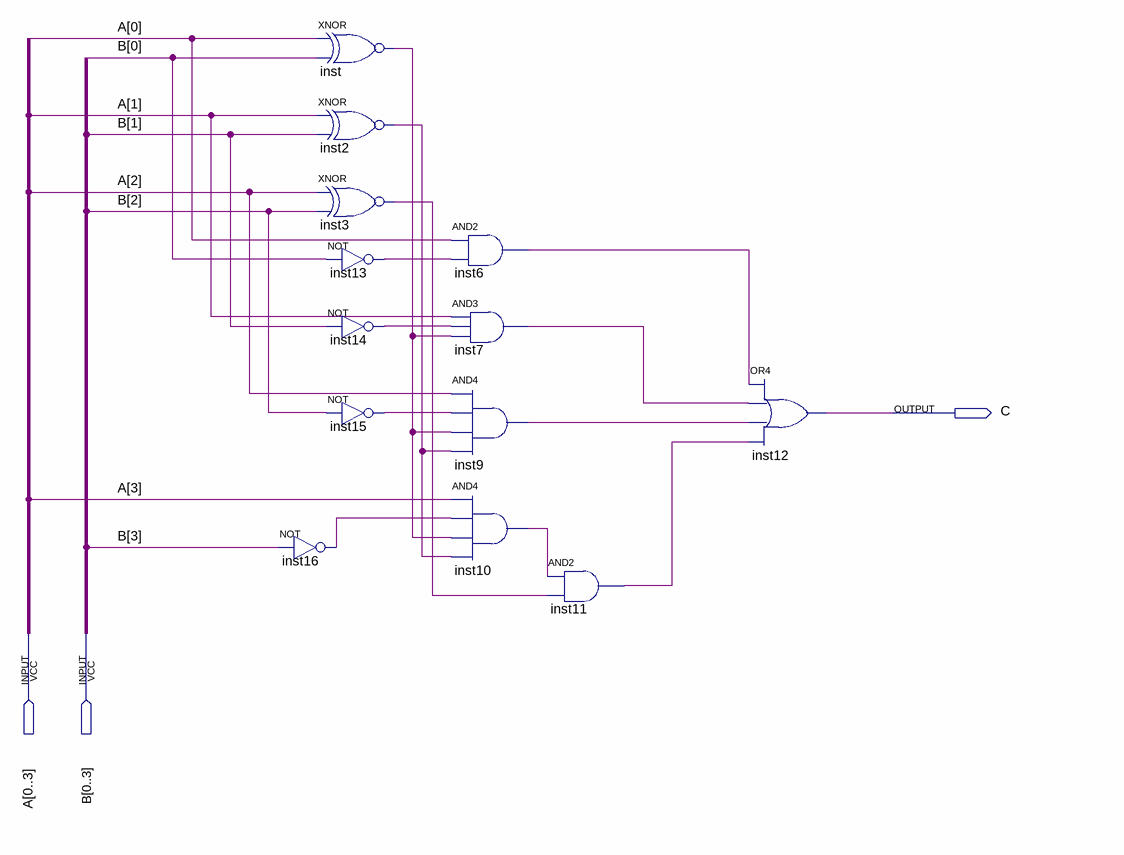
[diagram p0: schematic sheet]
// Quartus schematic AgtB.bdf as structural Verilog: 13 symbols, 3 pins
module AgtB (
  input  [0:3] A,
  input  [0:3] B,
  output C
);

  wire inst2_out, inst3_out, inst6_out, inst7_out, inst9_out, inst10_out, inst11_out, inst13_out, inst14_out,
       inst15_out, inst16_out, inst_out;

  not inst16 (inst16_out, B[3]);
  xnor inst (inst_out, A[0], B[0]);
  xnor inst2 (inst2_out, A[1], B[1]);
  xnor inst3 (inst3_out, A[2], B[2]);
  not inst13 (inst13_out, B[0]);
  not inst14 (inst14_out, B[1]);
  not inst15 (inst15_out, B[2]);
  and inst6 (inst6_out, A[0], inst13_out);
  and inst7 (inst7_out, A[1], inst14_out, inst_out);
  and inst9 (inst9_out, A[2], inst15_out, inst_out, inst2_out);
  and inst10 (inst10_out, A[3], inst16_out, inst_out, inst2_out);
  and inst11 (inst11_out, inst10_out, inst3_out);
  or inst12 (C, inst6_out, inst7_out, inst9_out, inst11_out);
endmodule
